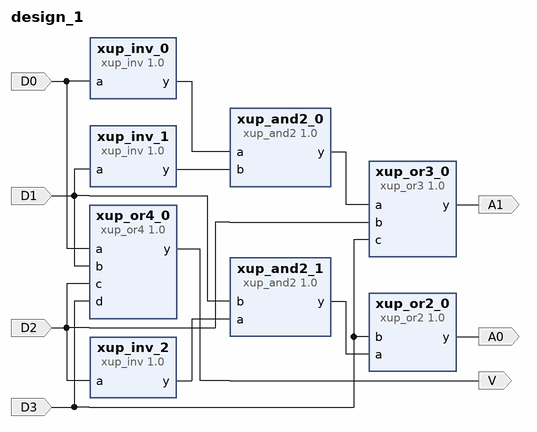
[diagram p0: block diagram of the top level]
# Vivado block design design_1, xc7a35tcpg236-1, Vivado 2023.1
create_bd_design design_1

create_bd_port -dir I D0
create_bd_port -dir I D1
create_bd_port -dir I D2
create_bd_port -dir I D3
create_bd_port -dir O A1
create_bd_port -dir O A0
create_bd_port -dir O V

create_bd_cell -type ip -vlnv xilinx.com:XUP:xup_and2:1.0 xup_and2_0
create_bd_cell -type ip -vlnv xilinx.com:XUP:xup_inv:1.0 xup_inv_0
create_bd_cell -type ip -vlnv xilinx.com:XUP:xup_inv:1.0 xup_inv_1
create_bd_cell -type ip -vlnv xilinx.com:XUP:xup_or3:1.0 xup_or3_0
create_bd_cell -type ip -vlnv xilinx.com:XUP:xup_inv:1.0 xup_inv_2
create_bd_cell -type ip -vlnv xilinx.com:XUP:xup_and2:1.0 xup_and2_1
create_bd_cell -type ip -vlnv xilinx.com:XUP:xup_or2:1.0 xup_or2_0
create_bd_cell -type ip -vlnv xilinx.com:XUP:xup_or4:1.0 xup_or4_0

# ---- connections ----

connect_bd_net -net D0_1 [get_bd_ports D0] [get_bd_pins xup_inv_0/a] [get_bd_pins xup_or4_0/a]
connect_bd_net -net D1_1 [get_bd_ports D1] [get_bd_pins xup_inv_1/a] [get_bd_pins xup_and2_1/b] [get_bd_pins xup_or4_0/b]
connect_bd_net -net D2_1 [get_bd_ports D2] [get_bd_pins xup_or3_0/b] [get_bd_pins xup_inv_2/a] [get_bd_pins xup_or4_0/c]
connect_bd_net -net D3_1 [get_bd_ports D3] [get_bd_pins xup_or3_0/c] [get_bd_pins xup_or2_0/b] [get_bd_pins xup_or4_0/d]
connect_bd_net [get_bd_pins xup_and2_0/y] [get_bd_pins xup_or3_0/a]
connect_bd_net [get_bd_pins xup_and2_1/y] [get_bd_pins xup_or2_0/a]
connect_bd_net [get_bd_pins xup_inv_0/y] [get_bd_pins xup_and2_0/a]
connect_bd_net [get_bd_pins xup_inv_1/y] [get_bd_pins xup_and2_0/b]
connect_bd_net [get_bd_pins xup_inv_2/y] [get_bd_pins xup_and2_1/a]
connect_bd_net [get_bd_pins xup_or2_0/y] [get_bd_ports A0]
connect_bd_net [get_bd_pins xup_or3_0/y] [get_bd_ports A1]
connect_bd_net [get_bd_pins xup_or4_0/y] [get_bd_ports V]

validate_bd_design
save_bd_design
